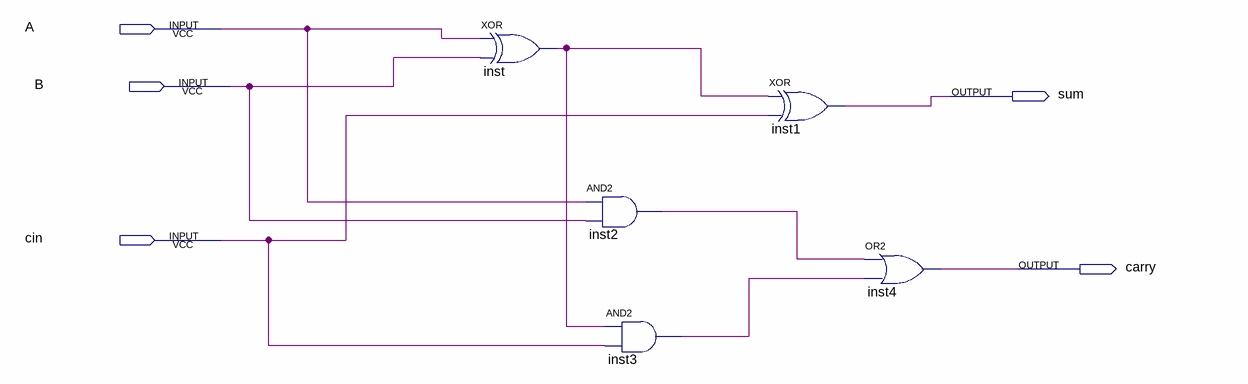
[diagram p0: schematic sheet]
// Quartus schematic FullAdder.bdf as structural Verilog: 5 symbols, 5 pins
module FullAdder (
  input  A,
  input  B,
  input  cin,
  output sum,
  output carry
);

  wire inst2_out, inst3_out, inst_out;

  xor inst (inst_out, A, B);
  and inst2 (inst2_out, A, B);
  and inst3 (inst3_out, inst_out, cin);
  xor inst1 (sum, inst_out, cin);
  or inst4 (carry, inst2_out, inst3_out);
endmodule
